# Altium schematic sheet 2_mpcie.SchDoc: Mini-PCIe and thermal sensor
size A4; OrganizationName: Pluton UPV; Address1: Universitat Politècnica; Address2: de València (UPV); Address3: Camí de Vera, València; Address4: Spain; SheetNumber: 2; SheetTotal: 6
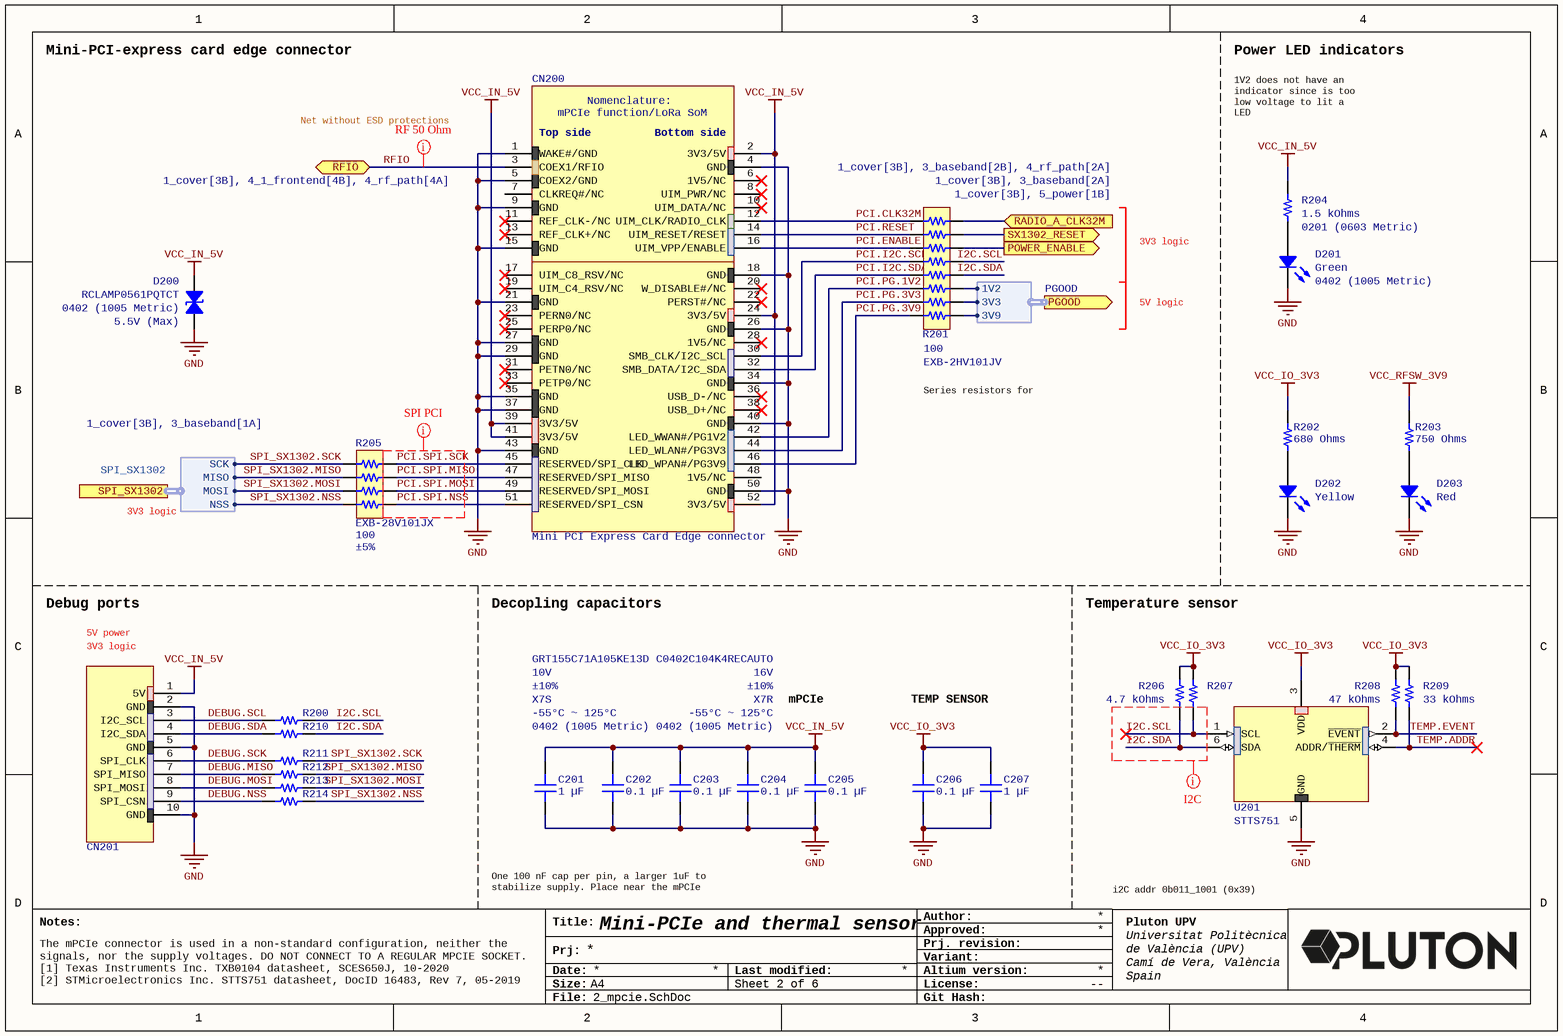
[diagram p0: 2_mpcie.SchDoc]

## Parts
C201  Part Number: GRT155C71A105KE13D  Device Package: 0402 (1005 Metric)  Operating Temperature: -55°C ~ 125°C  Temperature Coefficient: X7S  Tolerance: ±10%  Voltage - Rated: 10V  [CAP 0402_1005]  (hidden comment: 1 µF)
C202  Part Number: C0402C104K4RECAUTO  Operating Temperature: -55°C ~ 125°C  Package / Case: 0402 (1005 Metric)  Temperature Coefficient: X7R  Tolerance: ±10%  Voltage - Rated: 16V  [CAP 0402_1005]  (hidden comment: 0.1 µF)
C203  0.1 µF  [CAP 0402_1005]
C204  0.1 µF  [CAP 0402_1005]
C205  0.1 µF  [CAP 0402_1005]
C206  0.1 µF  [CAP 0402_1005]
C207  1 µF  [CAP 0402_1005]
CN200  Mini PCI Express Card Edge connector  [Mini PCI Express]  (no BOM)
CN201  (no value)  [header 1x10 2.54mm]
D200  Device Package: 0402 (1005 Metric)  Voltage - Reverse Standoff (Typ): 5.5V (Max)  [0402]  (hidden comment: RCLAMP0561PQTCT)
D201  Device Package: 0402 (1005 Metric)  [LED 0402_1005 GREEN]  (hidden comment: Green)
D202  Yellow  [LED 0402_1005 YELLOW]
D203  Red  [LED 0402_1005 RED]
R200  0 Ohms  [RES 0201_0603]  (value not drawn)
R201  Resistance (Ohms): 100  [RESNET 1506-16 CONVEX]  (hidden comment: EXB-2HV101JV)
R202  680 Ohms  [RES 0201_0603]
R203  750 Ohms  [RES 0201_0603]
R204  Device Package: 0201 (0603 Metric)  [RES 0201_0603]  (hidden comment: 1.5 kOhms)
R205  Resistance (Ohms): 100  Tolerance: ±5%  [RESNET 0804-8 CONVEX]  (hidden comment: EXB-28V101JX)
R206  4.7 kOhms  [RES 0201_0603]  (value not drawn)
R207  4.7 kOhms  [RES 0201_0603]
R208  47 kOhms  [RES 0201_0603]
R209  33 kOhms  [RES 0201_0603]
R210  0 Ohms  [RES 0201_0603]  (value not drawn)
R211  0 Ohms  [RES 0201_0603]  (value not drawn)
R212  0 Ohms  [RES 0201_0603]  (value not drawn)
R213  0 Ohms  [RES 0201_0603]  (value not drawn)
R214  0 Ohms  [RES 0201_0603]  (value not drawn)
U201  STTS751  [UDFN-6L]

## Ports
PGOOD (out, harness PGOOD, see 1_cover[3B], 5_power[1C]), POWER_ENABLE (out, see 1_cover[3B], 5_power[1B]), RADIO_A_CLK32M (in, see 1_cover[3B], 3_baseband[2B], 4_rf_path[2A]), RFIO (bidir, see 1_cover[3B], 4_1_frontend[4B], 4_rf_path[4A]), SPI_SX1302 (harness SPI_SX1302, see 1_cover[3B], 3_baseband[1A]), SX1302_RESET (out, see 1_cover[3B], 3_baseband[2A])

## Harnesses
SPI_SX1302: SCK, MISO, MOSI, NSS
PGOOD: 1V2, 3V3, 3V9

## Nets
GND: C201.1 C202.1 C203.1 C204.1 C205.1 C206.1 C207.1 CN200.1(WAKE#/GND) CN200.4(GND) CN200.5(COEX2/GND) CN200.9(GND) CN200.15(GND) CN200.18(GND) CN200.21(GND) CN200.26(GND) CN200.27(GND) CN200.29(GND) CN200.34(GND) CN200.35(GND) CN200.37(GND) CN200.40(GND) CN200.43(GND) CN200.50(GND) CN201.2(GND) CN201.5(GND) CN201.10(GND) D200.1 D201.2 D202.2 D203.2 U201.5(GND)
VCC_IN_5V: C201.2 C202.2 C203.2 C204.2 C205.2 CN200.2(3V3/5V) CN200.24(3V3/5V) CN200.39(3V3/5V) CN200.41(3V3/5V) CN200.52(3V3/5V) CN201.1(5V) D200.2 R204.2
VCC_IO_3V3: C206.2 C207.2 R202.2 R206.2 R207.2 R208.2 R209.2 U201.3(VDD)
VCC_RFSW_3V9: R203.2
DEBUG.MISO: CN201.7(SPI_MISO) R212.1
DEBUG.MOSI: CN201.8(SPI_MOSI) R213.1
DEBUG.NSS: CN201.9(SPI_CSN) R214.1
DEBUG.SCK: CN201.6(SPI_CLK) R211.1
DEBUG.SCL: CN201.3(I2C_SCL) R200.1
DEBUG.SDA: CN201.4(I2C_SDA) R210.1
I2C.SCL: R200.2 R201.13 R207.1 U201.1(SCL)
I2C.SDA: R201.12 R206.1 R210.2 U201.6(SDA)
PCI.CLK32M: CN200.12(UIM_CLK/RADIO_CLK) R201.1
PCI.ENABLE: CN200.16(UIM_VPP/ENABLE) R201.3
PCI.I2C.SCL: CN200.30(SMB_CLK/I2C_SCL) R201.4
PCI.I2C.SDA: CN200.32(SMB_DATA/I2C_SDA) R201.5
PCI.PG.1V2: CN200.42(LED_WWAN#/PG1V2) R201.6
PCI.PG.3V3: CN200.44(LED_WLAN#/PG3V3) R201.7
PCI.PG.3V9: CN200.46(LED_WPAN#/PG3V9) R201.8
PCI.RESET: CN200.14(UIM_RESET/RESET) R201.2
PCI.SPI.MISO: CN200.47(RESERVED/SPI_MISO) R205.6
PCI.SPI.MOSI: CN200.49(RESERVED/SPI_MOSI) R205.7
PCI.SPI.NSS: CN200.51(RESERVED/SPI_CSN) R205.8
PCI.SPI.SCK: CN200.45(RESERVED/SPI_CLK) R205.5
POWER_ENABLE: R201.14 ; port POWER_ENABLE
RADIO_A_CLK32M: R201.16 ; port RADIO_A_CLK32M
RFIO: CN200.3(COEX1/RFIO) ; port RFIO
SPI_SX1302.MISO: R205.3 R212.2 ; port SPI_SX1302.MISO
SPI_SX1302.MOSI: R205.2 R213.2 ; port SPI_SX1302.MOSI
SPI_SX1302.NSS: R205.1 R214.2 ; port SPI_SX1302.NSS
SPI_SX1302.SCK: R205.4 R211.2 ; port SPI_SX1302.SCK
SX1302_RESET: R201.15 ; port SX1302_RESET
TEMP.ADDR: R209.1 U201.4(ADDR/~{THERM})
TEMP.EVENT: R208.1 U201.2(~{EVENT})
NetD201_1: D201.1 R204.1
NetD202_1: D202.1 R202.1
NetD203_1: D203.1 R203.1
NetR201_9: R201.9 ; port PGOOD.3V9
NetR201_10: R201.10 ; port PGOOD.3V3
NetR201_11: R201.11 ; port PGOOD.1V2

Not connected (* = marked no-connect by the designer): CN200 6(1V5/NC)* 7(CLKREQ#/NC) 8(UIM_PWR/NC)* 10(UIM_DATA/NC)* 11(REF_CLK-/NC)* 13(REF_CLK+/NC)* 17(UIM_C8_RSV/NC)* 19(UIM_C4_RSV/NC)* 20(W_DISABLE#/NC)* 22(PERST#/NC)* 23(PERN0/NC)* 25(PERP0/NC)* 28(1V5/NC)* 31(PETN0/NC)* 33(PETP0/NC)* 36(USB_D-/NC)* 38(USB_D+/NC)* 48(1V5/NC)

## Layout directives
net class SPI PCI; rule Matched Net Lengths [Tolerance = 20mm]: PCI.SPI.MISO, PCI.SPI.MOSI, PCI.SPI.NSS, PCI.SPI.SCK
net class I2C; rule Matched Net Lengths [Tolerance = 20mm]: I2C.SCL, I2C.SDA
net class RF50; rule Width Constraint [Pref Impedance = 50.00ohms    Min Impedance = 50.00ohms    Max Impedance = 50.00ohms]; rule Clearance Constraint [Clearance = 0.2mm]: RFIO

## Notes on the sheet
- Mini-PCI-express card edge connector
- Power LED indicators
- Net without ESD protections
- 1V2 does not have an indicator since is too low voltage to lit a LED
- 3V3 logic
- 5V logic
- Series resistors for protection
- Debug ports
- (near CN201) 3V3 logic
- 5V power
- Decopling capacitors
- Temperature sensor
- mPCIe
- TEMP SENSOR
- One 100 nF cap per pin, a larger 1uF to stabilize supply. Place near the mPCIe pins.
- i2C addr 0b011_1001 (0x39)
- The mPCIe connector is used in a non-standard configuration, neither the signals, nor the supply voltages. DO NOT CONNECT TO A REGULAR MPCIE SOCKET.
  [1] Texas Instruments Inc. TXB0104 datasheet, SCES650J, 10-2020
  [2] STMicroelectronics Inc. STTS751 datasheet, DocID 16483, Rev 7, 05-2019
- Notes:
- Title:
- Author:
- Approved:
- Date:
- Prj:
- Size:
- A4
- Last modified:
- Altium version:
- Variant:
- Prj. revision:
- License:
- --
- File:
- Git Hash:
- (in symbol MiniPCIe Card) Nomenclature: / mPCIe function/LoRa SoM function; Top side; Bottom side

## Library data of the parts
C201 = GRT155C71A105KE13D: CAP CER 1UF 10V X7S 0402; manufacturer: Murata Electronics; Value: 1 µF; Applications: Automotive; Capacitance: 1 µF; componentlink1description: Datasheet; componentlink1url: https://search.murata.co.jp/Ceramy/image/img/A01X/G101/ENG/GRT155C71A105KE13-01.pdf; componentlink2description: DigiKey Link; componentlink2url: https://www.digikey.com/en/products/detail/murata-electronics/GRT155C71A105KE13D/10695747; lastupdated: 09/02/2024 20:04:05; Lifecycle Status: Active; Minimum Order: 1; Mounting Type: Surface Mount, MLCC; Package / Case: 0402 (1005 Metric); packaging: TapeAndReel; partid: 47127; Part Status: Active; price: 0.04; Ratings: AEC-Q200; series: GRT; Size / Dimension: 0.039" L x 0.020" W (1.00mm x 0.50mm); Supplier 1: DigiKey; Supplier Part Number 1: 490-GRT155C71A105KE13DCT-ND; Thickness (Max): 0.024" (0.60mm)
C202-C206 = C0402C104K4RECAUTO: CAP CER 0402 0.1UF 16V X7R 10%; manufacturer: KEMET; Value: 0.1 µF; Applications: Automotive, ESD Protection; Capacitance: 0.1 µF; componentlink1description: Datasheet; componentlink1url: https://api.kemet.com/component-edge/download/datasheet/C0402C104K4RECAUTO.pdf; componentlink2description: DigiKey Link; componentlink2url: https://www.digikey.com/en/products/detail/kemet/C0402C104K4RECAUTO/8563695; Device Package: 0402 (1005 Metric); lastupdated: 09/02/2024 20:04:38; Lifecycle Status: Active; Minimum Order: 1; Mounting Type: Surface Mount, MLCC; packaging: TapeAndReel; partid: 1731; Part Status: Active; price: 0.01; Ratings: AEC-Q200; series: ESD SMD Auto X7R; Size / Dimension: 0.039" L x 0.020" W (1.00mm x 0.50mm); Supplier 1: DigiKey; Supplier Part Number 1: 399-17167-1-ND; Thickness (Max): 0.022" (0.55mm)
  C203-C206: Part Number: C0402C104K4RECAUTO; Operating Temperature: -55°C ~ 125°C; Package / Case: 0402 (1005 Metric); Temperature Coefficient: X7R; Tolerance: ±10%; Voltage - Rated: 16V
C207 = GRT155C71A105KE13D: CAP CER 1UF 10V X7S 0402; manufacturer: Murata Electronics; Tolerance: ±10%; Part Number: GRT155C71A105KE13D; Value: 1 µF; Applications: Automotive; Capacitance: 1 µF; componentlink1description: Datasheet; componentlink1url: https://search.murata.co.jp/Ceramy/image/img/A01X/G101/ENG/GRT155C71A105KE13-01.pdf; componentlink2description: DigiKey Link; componentlink2url: https://www.digikey.com/en/products/detail/murata-electronics/GRT155C71A105KE13D/10695747; Device Package: 0402 (1005 Metric); lastupdated: 09/02/2024 20:04:05; Lifecycle Status: Active; Minimum Order: 1; Mounting Type: Surface Mount, MLCC; Operating Temperature: -55°C ~ 125°C; Package / Case: 0402 (1005 Metric); packaging: TapeAndReel; partid: 47127; Part Status: Active; price: 0.04; Ratings: AEC-Q200; series: GRT; Size / Dimension: 0.039" L x 0.020" W (1.00mm x 0.50mm); Supplier 1: DigiKey; Supplier Part Number 1: 490-GRT155C71A105KE13DCT-ND; Temperature Coefficient: X7S; Thickness (Max): 0.024" (0.60mm); Voltage - Rated: 10V
CN200 = MiniPCIe Card: System: Connector
CN201 = SoM debug header: Specific debug port for the LoRa gateway SoM
D200 = RCLAMP0561PQTCT: 1-LINE 5V 0.15PF 1.1R ESD SLP100; Manufacturer: Semtech Corporation; Bidirectional Channels: 1; Capacitance @ Frequency: 0.14pF @ 1MHz; Current - Peak Pulse (10/1000µs): 2A (8/20µs); Power Line Protection: No; Power - Peak Pulse: 40W; Type: Zener; Voltage - Breakdown (Min): 6.5V; Voltage - Clamping (Max) @ Ipp: 20V; Part Number: RCLAMP0561PQTCT; Applications: HDMI, USB; ComponentLink1Description: Datasheet; ComponentLink1URL: https://semtech.my.salesforce.com/sfc/p/#E0000000JelG/a/2R000000UtDi/1jVA5kaukM6E3zuZeKc6Qe4VpVKspnyk2AdLBSY77Ow; ComponentLink2Description: DigiKey Link; ComponentLink2URL: https://www.digikey.com/en/products/detail/semtech-corporation/RCLAMP0561PQTCT/20370677; LastUpdated: 03/06/2024 20:22:58; Lifecycle Status: Active; Minimum Order: 1; Mounting Type: Surface Mount; Operating Temperature: -40°C ~ 125°C (TJ); Package / Case: 0402 (1005 Metric); Packaging: TapeAndReel; PartId: 11797; Price: 0.13; Series: RailClamp®; Supplier 1: DigiKey; Supplier Part Number 1: 600-RCLAMP0561PQTCT-ND; Supplier Device Package: SLP1006P2
D201 = EAST10052GA0: LED GREEN CLEAR 2SMD; Manufacturer: Everlight Electronics Co Ltd; Configuration: Standard; Current - Test: 5mA; Lens Color: Colorless; Lens Size: 1.00mm x 0.50mm; Lens Style: Rectangle with Flat Top; Viewing Angle: 120°; Voltage - Forward (Vf) (Typ): 2.95V; Wavelength - Peak: 518nm; Part Number: EAST10052GA0; Color: Green; ComponentLink1Description: Datasheet; ComponentLink1URL: https://everlightamericas.com/index.php?controller=attachment&id_attachment=3256; ComponentLink2Description: DigiKey Link; ComponentLink2URL: https://www.digikey.com/en/products/detail/everlight-electronics-co-ltd/EAST10052GA0/8510366; Height (Max): 0.25mm; LastUpdated: 03/06/2024 19:58:14; Lens Transparency: Clear; Lifecycle Status: Active; Minimum Order: 1; Mounting Type: Surface Mount; Package / Case: 0402 (1005 Metric); Packaging: TapeAndReel; PartId: 696; Part Status: Active; Price: 0.09; Series: -; Size / Dimension: 1.00mm L x 0.50mm W; Supplier 1: DigiKey; Supplier Part Number 1: 1080-1557-1-ND; Supplier Device Package: 2-SMD; Value: Green
D202 = FHY1105P-TR: LED YELLOW CLEAR 1005 SMD; Manufacturer: Stanley Electric Co; Configuration: Standard; Current - Test: 5mA; Lens Color: Colorless; Lens Size: 1.00mm x 0.50mm; Lens Style: Rectangle with Flat Top; Millicandela Rating: 32mcd; Voltage - Forward (Vf) (Typ): 1.9V; Wavelength - Dominant: 590nm; Wavelength - Peak: 594nm; Part Number: FHY1105P-TR; Color: Yellow; ComponentLink1Description: Datasheet; ComponentLink1URL: http://www.stanley-components.com/php/downloaddatafile.php?rp=0,FHY1105P-TR_e.pdf; ComponentLink2Description: DigiKey Link; ComponentLink2URL: https://www.digikey.com/en/products/detail/stanley-electric-co/FHY1105P-TR/6205303; Device Package: 0402 (1005 Metric); Height (Max): 0.25mm; LastUpdated: 03/06/2024 20:00:47; Lens Transparency: Clear; Lifecycle Status: Active; Minimum Order: 1; Mounting Type: Surface Mount; Package / Case: 0402 (1005 Metric); Packaging: TapeAndReel; PartId: 166; Part Status: Active; Price: 0.05; Series: -; Size / Dimension: 1.00mm L x 0.50mm W; Supplier 1: DigiKey; Supplier Part Number 1: 404-1209-1-ND; Supplier Device Package: 1005; Value: Yellow
D203 = EAST10053RA0: LED RED CLEAR 2SMD; Manufacturer: Everlight Electronics Co Ltd; Configuration: Standard; Current - Test: 5mA; Lens Color: Colorless; Lens Size: 1.00mm x 0.50mm; Lens Style: Rectangle with Flat Top; Viewing Angle: 120°; Voltage - Forward (Vf) (Typ): 2.05V; Wavelength - Peak: 639nm; Part Number: EAST10053RA0; Color: Red; ComponentLink1Description: Datasheet; ComponentLink1URL: https://everlightamericas.com/index.php?controller=attachment&id_attachment=3575; ComponentLink2Description: DigiKey Link; ComponentLink2URL: https://www.digikey.com/en/products/detail/everlight-electronics-co-ltd/EAST10053RA0/8510365; Device Package: 0402 (1005 Metric); Height (Max): 0.35mm; LastUpdated: 03/06/2024 19:59:17; Lens Transparency: Clear; Lifecycle Status: Active; Minimum Order: 1; Mounting Type: Surface Mount; Package / Case: 0402 (1005 Metric); Packaging: TapeAndReel; PartId: 508; Part Status: Active; Price: 0.05; Series: -; Size / Dimension: 1.00mm L x 0.50mm W; Supplier 1: DigiKey; Supplier Part Number 1: 1080-1556-1-ND; Supplier Device Package: 2-SMD; Value: Red
R200 R210-R214 = AC0201JR-070RL: RES SMD 0 OHM JUMPER 1/20W 0201; Manufacturer: Yageo; Power (Watts): 0.05W, 1/20W; Part Number: AC0201JR-070RL; Value: 0 Ohms; ComponentLink1Description: Datasheet; ComponentLink1URL: https://www.yageo.com/upload/media/product/productsearch/datasheet/rchip/PYu-AC_51_RoHS_L_7.pdf; ComponentLink2Description: DigiKey Link; ComponentLink2URL: https://www.digikey.com/en/products/detail/yageo/AC0201JR-070RL/5894880; Composition: Thick Film; Device Package: 0201 (0603 Metric); Features: Automotive AEC-Q200, Moisture Resistant; Height - Seated (Max): 0.010" (0.26mm); LastUpdated: 04/06/2024 19:12:00; Lifecycle Status: Active; Minimum Order: 1; Number of Terminations: 2; Operating Temperature: -55°C ~ 155°C; Package / Case: 0201 (0603 Metric); Packaging: CutTape; PartId: 818; Part Status: Active; Price: 0.01; Ratings: AEC-Q200; Resistance: 0 Ohms; Series: AC; Size / Dimension: 0.024" L x 0.012" W (0.60mm x 0.30mm); Supplier 1: DigiKey; Supplier Part Number 1: YAG3427CT-ND; Supplier Device Package: 0201; Tolerance: Jumper
R201 = EXB-2HV101JV: RES ARRAY 8 RES 100 OHM 1506; Manufacturer: Panasonic Electronic Components; Circuit Type: Isolated; Number of Resistors: 8; Power Per Element: 62.5mW; Temperature Coefficient: ±200ppm/°C; Tolerance: ±5%; Part Number: EXB-2HV101JV; Applications: Automotive AEC-Q200; ComponentLink1Description: Datasheet; ComponentLink1URL: https://industrial.panasonic.com/cdbs/www-data/pdf/AOC0000/AOC0000C14.pdf; ComponentLink2Description: DigiKey Link; ComponentLink2URL: https://www.digikey.com/en/products/detail/panasonic-electronic-components/EXB-2HV101JV/285307; Height - Seated (Max): 0.022" (0.55mm); LastUpdated: 03/06/2024 20:06:00; Lifecycle Status: Active; Minimum Order: 1; Mounting Type: Surface Mount; Number of Pins: 16; Operating Temperature: -55°C ~ 125°C; Package / Case: 1506, Convex, Long Side Terminals; Packaging: TapeAndReel; PartId: 664; Part Status: Active; Price: 0.03; Series: EXB; Size / Dimension: 0.150" L x 0.063" W (3.80mm x 1.60mm); Supplier 1: DigiKey; Supplier Part Number 1: Y1101CT-ND; Supplier Device Package: 1506
R202 = RC0201JR-07680RL: RES 680 OHM 5% 1/20W 0201; Manufacturer: Yageo; Power (Watts): 0.05W, 1/20W; Temperature Coefficient: ±200ppm/°C; Part Number: RC0201JR-07680RL; Value: 680 Ohms; ComponentLink1Description: Datasheet; ComponentLink1URL: https://www.yageo.com/upload/media/product/productsearch/datasheet/rchip/PYu-RC_Group_51_RoHS_L_10.pdf; ComponentLink2Description: DigiKey Link; ComponentLink2URL: https://www.digikey.com/en/products/detail/yageo/RC0201JR-07680RL/1948962; Composition: Thick Film; Device Package: 0201 (0603 Metric); Features: Moisture Resistant; Height - Seated (Max): 0.010" (0.26mm); LastUpdated: 04/06/2024 19:12:00; Lifecycle Status: Active; Minimum Order: 1; Number of Terminations: 2; Operating Temperature: -55°C ~ 125°C; Package / Case: 0201 (0603 Metric); Packaging: CutTape; PartId: 715; Part Status: Active; Price: 0.01; Resistance: 680 Ohms; Series: RC_L; Size / Dimension: 0.024" L x 0.012" W (0.60mm x 0.30mm); Supplier 1: DigiKey; Supplier Part Number 1: 311-680NCT-ND; Supplier Device Package: 0201; Tolerance: ±5%
R203 = RC0201JR-07750RL: RES 750 OHM 5% 1/20W 0201; Manufacturer: Yageo; Power (Watts): 0.05W, 1/20W; Temperature Coefficient: ±200ppm/°C; Part Number: RC0201JR-07750RL; Value: 750 Ohms; ComponentLink1Description: Datasheet; ComponentLink1URL: https://www.yageo.com/upload/media/product/productsearch/datasheet/rchip/PYu-RC_Group_51_RoHS_L_10.pdf; ComponentLink2Description: DigiKey Link; ComponentLink2URL: https://www.digikey.com/en/products/detail/yageo/RC0201JR-07750RL/5280787; Composition: Thick Film; Device Package: 0201 (0603 Metric); Features: Moisture Resistant; Height - Seated (Max): 0.010" (0.26mm); LastUpdated: 04/06/2024 19:11:57; Lifecycle Status: Active; Minimum Order: 1; Number of Terminations: 2; Operating Temperature: -55°C ~ 125°C; Package / Case: 0201 (0603 Metric); Packaging: CutTape; PartId: 1858; Part Status: Active; Price: 0.01; Resistance: 750 Ohms; Series: RC_L; Size / Dimension: 0.024" L x 0.012" W (0.60mm x 0.30mm); Supplier 1: DigiKey; Supplier Part Number 1: YAG2927CT-ND; Supplier Device Package: 0201; Tolerance: ±5%
R204 = CRCW02011K50JNED: RES SMD 1.5K OHM 5% 1/20W 0201; Manufacturer: Vishay Dale; Power (Watts): 0.05W, 1/20W; Temperature Coefficient: ±200ppm/°C; Part Number: CRCW02011K50JNED; Value: 1.5 kOhms; ComponentLink1Description: Datasheet; ComponentLink1URL: http://www.vishay.com/docs/20052/crcw0201e3.pdf; ComponentLink2Description: DigiKey Link; ComponentLink2URL: http://digikey.com/product-detail/en/vishay-dale/CRCW02011K50JNED/541-CRCW02011K50JNEDCT-ND/10449419; Composition: Thick Film; Height - Seated (Max): 0.011" (0.28mm); LastUpdated: 04/06/2024 19:12:01; Lifecycle Status: Active; Minimum Order: 1; Number of Terminations: 2; Operating Temperature: -55°C ~ 155°C; Package / Case: 0201 (0603 Metric); Packaging: CutTape; PartId: 491; Part Status: Active; Price: 0.10; Resistance: 1.5 kOhms; Series: CRCW; Size / Dimension: 0.024" L x 0.012" W (0.60mm x 0.30mm); Supplier 1: DigiKey; Supplier Part Number 1: 541-CRCW02011K50JNEDCT-ND; Supplier Device Package: 0201; Tolerance: ±5%
R205 = Resistor Array (4 circuit): RES ARRAY 4 RES 100 OHM 0804; Manufacturer: Panasonic Electronic Components; Circuit Type: Isolated; Number of Resistors: 4; Power Per Element: 62.5mW; Temperature Coefficient: ±200ppm/°C; Applications: Automotive AEC-Q200; ComponentLink1Description: Datasheet; ComponentLink1URL: https://industrial.panasonic.com/cdbs/www-data/pdf/AOC0000/AOC0000C14.pdf; ComponentLink2Description: DigiKey Link; ComponentLink2URL: https://www.digikey.com/en/products/detail/panasonic-electronic-components/EXB-28V101JX/256275; Height - Seated (Max): 0.018" (0.45mm); LastUpdated: 03/06/2024 20:05:56; Lifecycle Status: Active; Minimum Order: 1; Mounting Type: Surface Mount; Number of Pins: 8; Operating Temperature: -55°C ~ 125°C; Package / Case: 0804, Convex, Long Side Terminals; Packaging: TapeAndReel; PartId: 463; Part Status: Active; Price: 0.01; Series: EXB; Size / Dimension: 0.079" L x 0.039" W (2.00mm x 1.00mm); Supplier 1: DigiKey; Supplier Part Number 1: Y7101CT-ND; Supplier Device Package: 0804; Part Number: EXB-28V101JX
R206 R207 = AC0201FR-074K7L: RES SMD 4.7K OHM 1% 1/20W 0201; Manufacturer: Yageo; Power (Watts): 0.05W, 1/20W; Temperature Coefficient: ±200ppm/°C; Part Number: AC0201FR-074K7L; Value: 4.7 kOhms; ComponentLink1Description: Datasheet; ComponentLink1URL: https://www.yageo.com/upload/media/product/productsearch/datasheet/rchip/PYu-AC_51_RoHS_L_7.pdf; ComponentLink2Description: DigiKey Link; ComponentLink2URL: https://www.digikey.com/en/products/detail/yageo/AC0201FR-074K7L/5894686; Composition: Thick Film; Device Package: 0201 (0603 Metric); Features: Automotive AEC-Q200, Moisture Resistant; Height - Seated (Max): 0.010" (0.26mm); LastUpdated: 04/06/2024 19:11:59; Lifecycle Status: Active; Minimum Order: 1; Number of Terminations: 2; Operating Temperature: -55°C ~ 155°C; Package / Case: 0201 (0603 Metric); Packaging: CutTape; PartId: 978; Part Status: Active; Price: 0.01; Ratings: AEC-Q200; Resistance: 4.7 kOhms; Series: AC; Size / Dimension: 0.024" L x 0.012" W (0.60mm x 0.30mm); Supplier 1: DigiKey; Supplier Part Number 1: YAG3426CT-ND; Supplier Device Package: 0201; Tolerance: ±1%
R208 = AC0201FR-0747KL: RES SMD 47K OHM 1% 1/20W 0201; Manufacturer: Yageo; Power (Watts): 0.05W, 1/20W; Temperature Coefficient: ±200ppm/°C; Part Number: AC0201FR-0747KL; Value: 47 kOhms; ComponentLink1Description: Datasheet; ComponentLink1URL: https://www.yageo.com/upload/media/product/productsearch/datasheet/rchip/PYu-AC_51_RoHS_L_7.pdf; ComponentLink2Description: DigiKey Link; ComponentLink2URL: https://www.digikey.com/en/products/detail/yageo/AC0201FR-0747KL/5894664; Composition: Thick Film; Device Package: 0201 (0603 Metric); Features: Automotive AEC-Q200, Moisture Resistant; Height - Seated (Max): 0.010" (0.26mm); LastUpdated: 04/06/2024 19:11:58; Lifecycle Status: Active; Minimum Order: 1; Number of Terminations: 2; Operating Temperature: -55°C ~ 155°C; Package / Case: 0201 (0603 Metric); Packaging: TapeAndReel; PartId: 1633; Part Status: Active; Price: 0.01; Ratings: AEC-Q200; Resistance: 47 kOhms; Series: AC; Size / Dimension: 0.024" L x 0.012" W (0.60mm x 0.30mm); Supplier 1: DigiKey; Supplier Part Number 1: YAG3425CT-ND; Supplier Device Package: 0201; Tolerance: ±1%
R209 = CRCW020133K0FKED: RES SMD 33K OHM 1% 1/20W 0201; Manufacturer: Vishay Dale; Power (Watts): 0.05W, 1/20W; Temperature Coefficient: ±100ppm/°C; Part Number: CRCW020133K0FKED; Value: 33 kOhms; ComponentLink1Description: Datasheet; ComponentLink1URL: http://www.vishay.com/docs/20052/crcw0201e3.pdf; ComponentLink2Description: DigiKey Link; ComponentLink2URL: https://www.digikey.com/en/products/detail/vishay-dale/CRCW020133K0FKED/1968120; Composition: Thick Film; Device Package: 0201 (0603 Metric); Height - Seated (Max): 0.010" (0.26mm); LastUpdated: 04/06/2024 19:12:00; Lifecycle Status: Active; Minimum Order: 1; Number of Terminations: 2; Operating Temperature: -55°C ~ 155°C; Package / Case: 0201 (0603 Metric); Packaging: TapeAndReel; PartId: 866; Part Status: Active; Price: 0.02; Resistance: 33 kOhms; Series: CRCW0201 e3; Size / Dimension: 0.024" L x 0.012" W (0.60mm x 0.30mm); Supplier 1: DigiKey; Supplier Part Number 1: 541-33.0KAABCT-ND; Supplier Device Package: 201; Tolerance: ±1%
U201 = STTS751: 2.25 V low-voltage local digital temperature sensor